# EAGLE design Micromouse Arduino Nano (EAGLE 9.6.2)

## Sheet 1 of 4
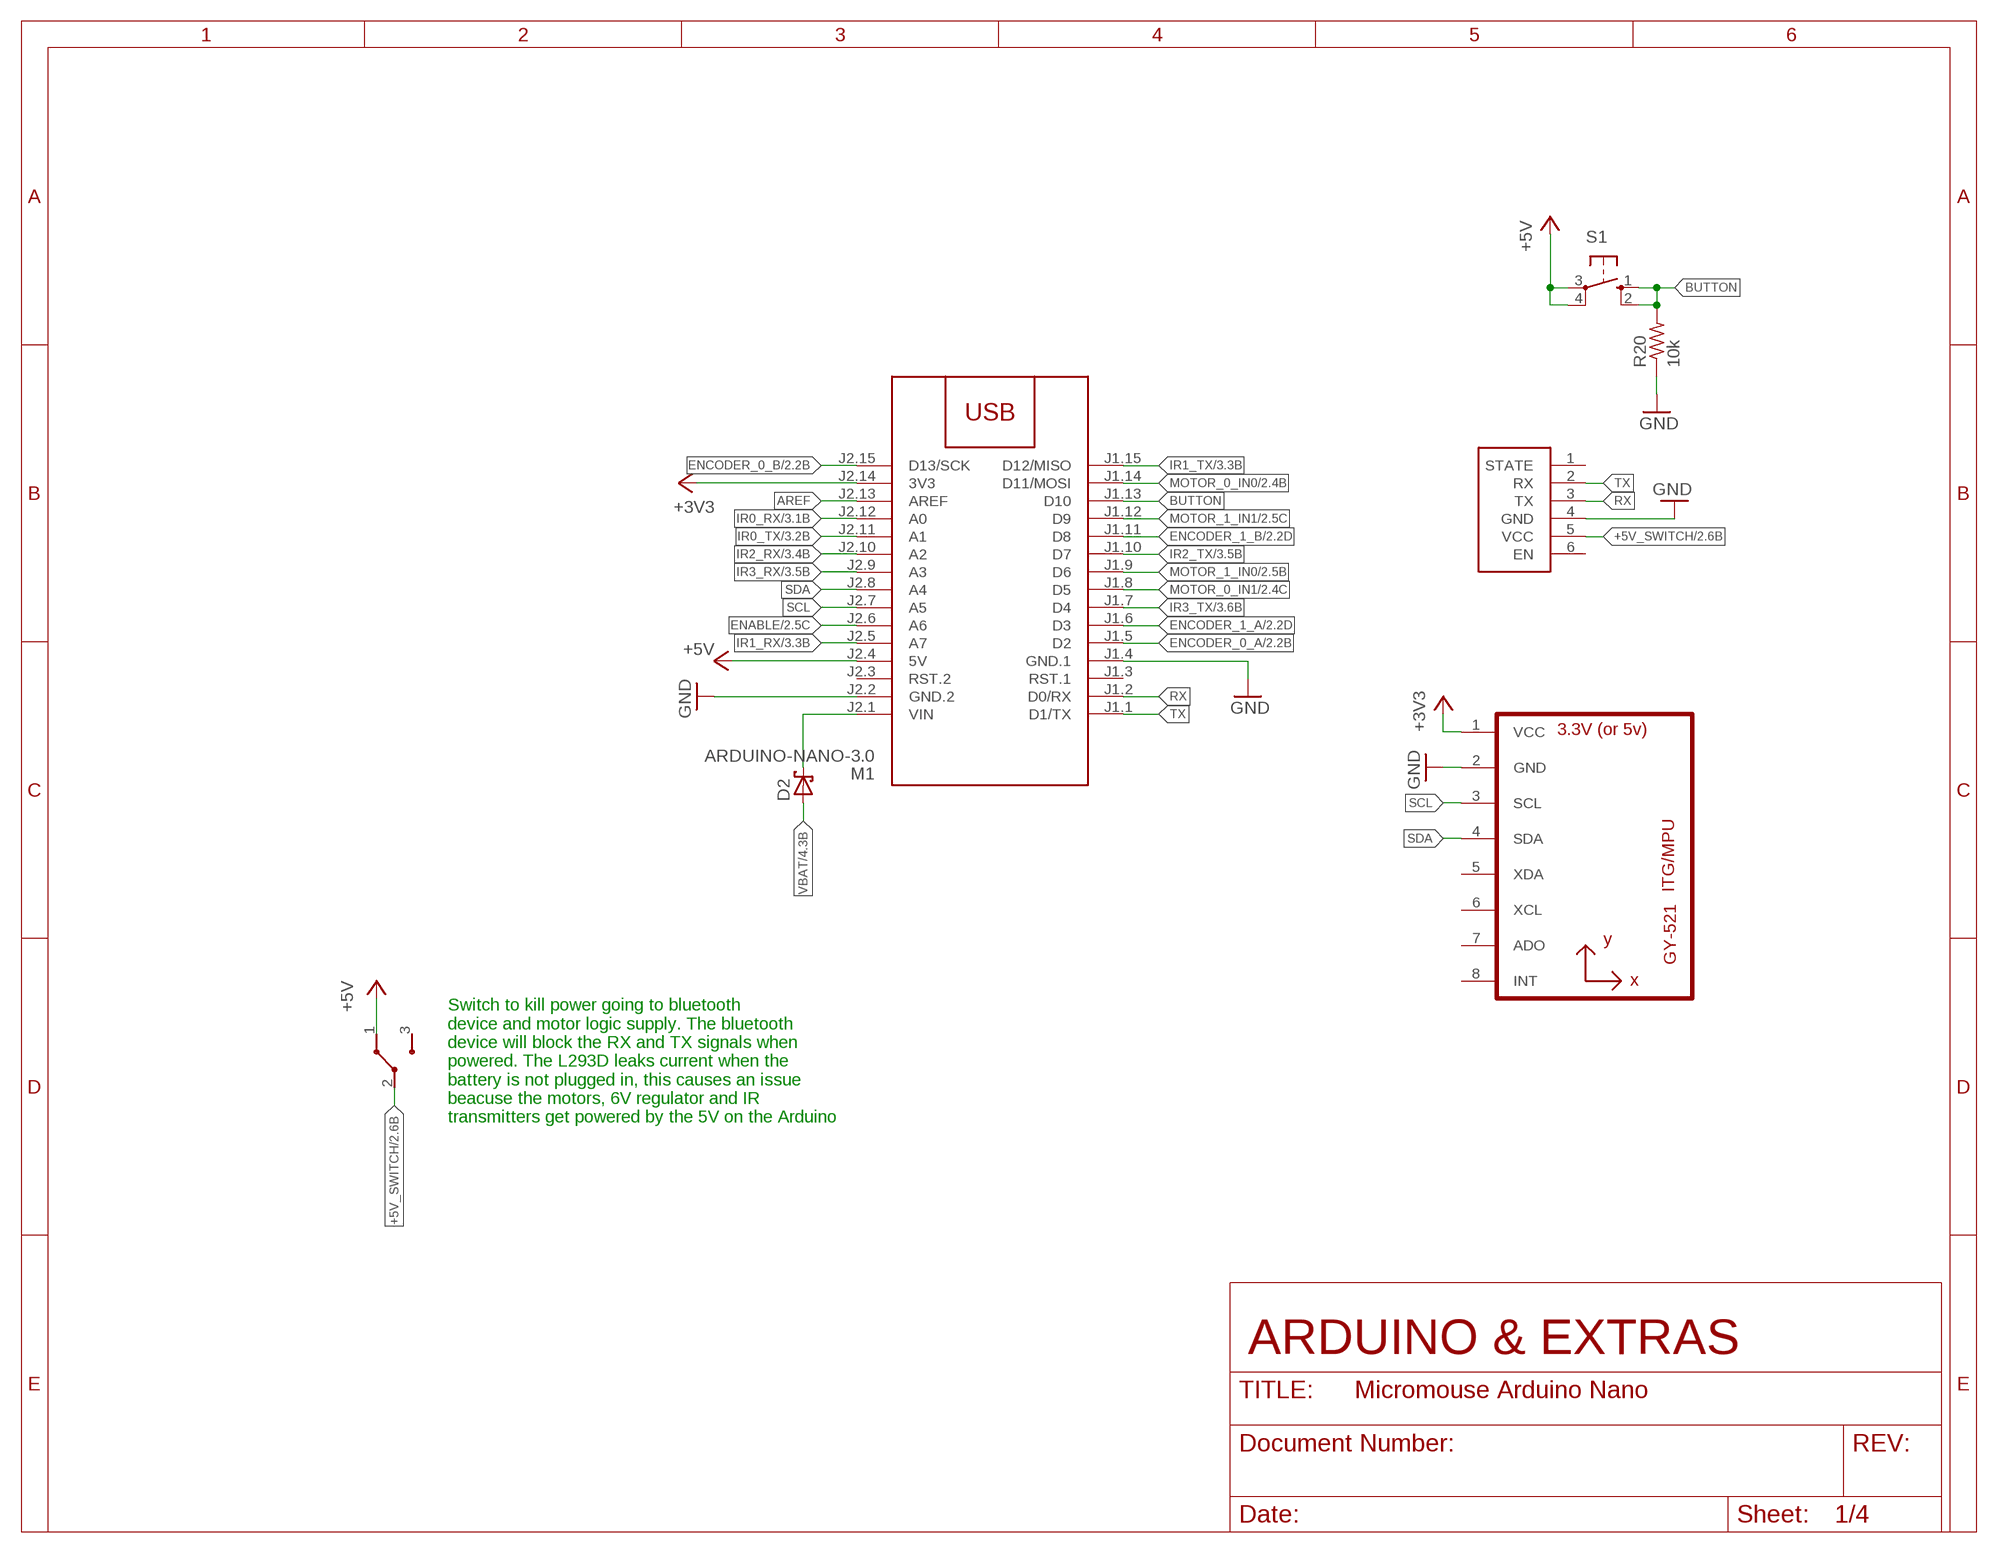
[diagram p0: schematic, sheet 1]

### Parts
D2  SCHOTTKY-DIODEDO41-7  [DO41-7]
M1  ARDUINO-NANO-3.0  [ARDUINO-NANO-3.0]
R20  10k  R-US_0207/2V  [0207/2V]
S1  10-XX  [B3F-10XX]
U1  GY-521MPU6050  [GY-521]
U$9  HC-05  [HC-05]
U$10  K3-1260D  [K3-1260D]

### Nets
+3V3: M1.J2.14(3V3) U1.1(VCC)
+5V: M1.J2.4(5V) S1.3(P) S1.4(P1) U$10.1 ; also sheet 2,3
+5V_SWITCH: U$9.5(VCC) U$10.2 ; also sheet 2
AREF: M1.J2.13(AREF)
BUTTON: M1.J1.13(D10) R20.2 S1.1(S) S1.2(S1)
ENABLE: M1.J2.6(A6) ; also sheet 2
ENCODER_0_A: M1.J1.5(D2) ; also sheet 2
ENCODER_0_B: M1.J2.15(D13/SCK) ; also sheet 2
ENCODER_1_A: M1.J1.6(D3) ; also sheet 2
ENCODER_1_B: M1.J1.11(D8) ; also sheet 2
GND: M1.J1.4(GND.1) M1.J2.2(GND.2) R20.1 U1.2(GND) U$9.4(GND) ; also sheet 2,3,4
IR0_RX: M1.J2.12(A0) ; also sheet 3
IR0_TX: M1.J2.11(A1) ; also sheet 3
IR1_RX: M1.J2.5(A7) ; also sheet 3
IR1_TX: M1.J1.15(D12/MISO) ; also sheet 3
IR2_RX: M1.J2.10(A2) ; also sheet 3
IR2_TX: M1.J1.10(D7) ; also sheet 3
IR3_RX: M1.J2.9(A3) ; also sheet 3
IR3_TX: M1.J1.7(D4) ; also sheet 3
MOTOR_0_IN0: M1.J1.14(D11/MOSI) ; also sheet 2
MOTOR_0_IN1: M1.J1.8(D5) ; also sheet 2
MOTOR_1_IN0: M1.J1.9(D6) ; also sheet 2
MOTOR_1_IN1: M1.J1.12(D9) ; also sheet 2
N$7: D2.C M1.J2.1(VIN)
RX: M1.J1.2(D0/RX) U$9.3(TX)
SCL: M1.J2.7(A5) U1.3(SCL)
SDA: M1.J2.8(A4) U1.4(SDA)
TX: M1.J1.1(D1/TX) U$9.2(RX)
VBAT: D2.A ; also sheet 4
Unconnected: M1.J1.3(RST.1) M1.J2.3(RST.2) U1.5(XDA) U1.6(XCL) U1.7(ADO) U1.8(INT) U$9.1(STATE) U$9.6(EN) U$10.3

### Notes on the sheet
- Switch to kill power going to bluetooth 
  device and motor logic supply. The bluetooth 
  device will block the RX and TX signals when 
  powered. The L293D leaks current when the 
  battery is not plugged in, this causes an issue 
  beacuse the motors, 6V regulator and IR 
  transmitters get powered by the 5V on the Arduino
- ARDUINO & EXTRAS

## Sheet 2 of 4
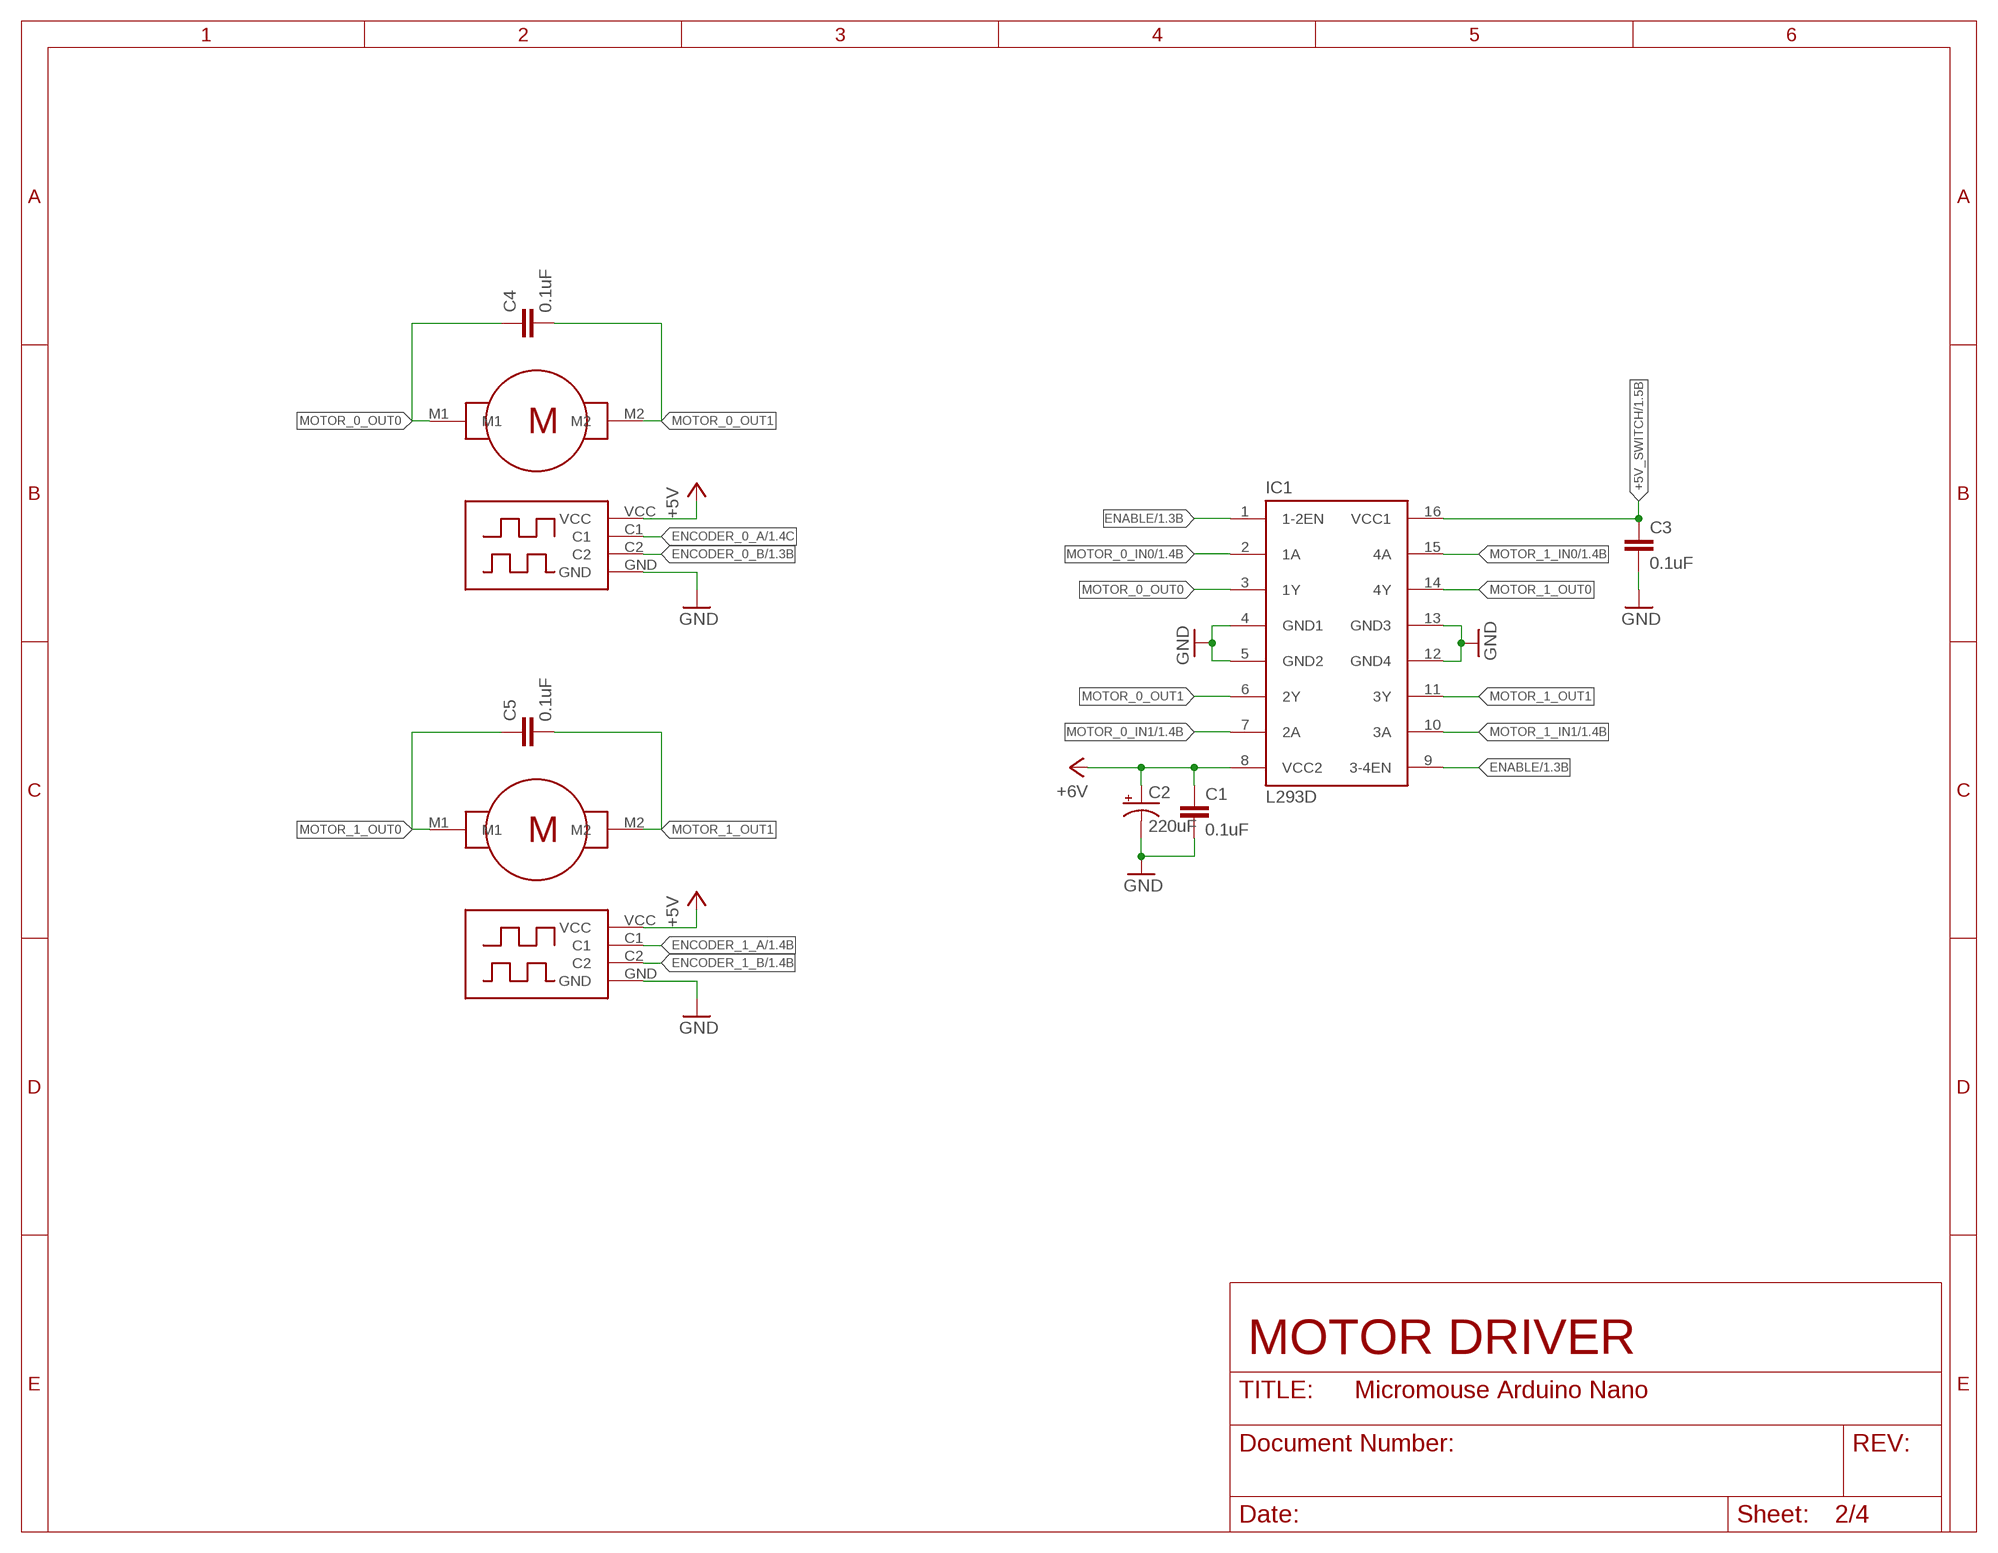
[diagram p1: schematic, sheet 2]

### Parts
C1  0.1uF  C-EU050-025X075  [C050-025X075]
C2  220uF  CPOL-USE2.5-6  [E2,5-6]
C3  0.1uF  C-EU050-025X075  [C050-025X075]
C4  0.1uF  C-EU050-025X075  [C050-025X075]
C5  0.1uF  C-EU050-025X075  [C050-025X075]
IC1  L293D  [DIL16]
U$1  DC_MOTOR  [DC_MOTOR]
U$2  DC_MOTOR  [DC_MOTOR]

### Nets
+5V: U$1.VCC U$2.VCC ; also sheet 1,3
+5V_SWITCH: C3.1 IC1.16(VCC1) ; also sheet 1
ENABLE: IC1.1(1-2EN) IC1.9(3-4EN) ; also sheet 1
ENCODER_0_A: U$1.C1 ; also sheet 1
ENCODER_0_B: U$1.C2 ; also sheet 1
ENCODER_1_A: U$2.C1 ; also sheet 1
ENCODER_1_B: U$2.C2 ; also sheet 1
GND: C1.2 C2.- C3.2 IC1.4(GND1) IC1.5(GND2) IC1.12(GND4) IC1.13(GND3) U$1.GND U$2.GND ; also sheet 1,3,4
MOTOR_0_IN0: IC1.2(1A) ; also sheet 1
MOTOR_0_IN1: IC1.7(2A) ; also sheet 1
MOTOR_0_OUT0: C4.1 IC1.3(1Y) U$1.M1
MOTOR_0_OUT1: C4.2 IC1.6(2Y) U$1.M2
MOTOR_1_IN0: IC1.15(4A) ; also sheet 1
MOTOR_1_IN1: IC1.10(3A) ; also sheet 1
MOTOR_1_OUT0: C5.1 IC1.14(4Y) U$2.M1
MOTOR_1_OUT1: C5.2 IC1.11(3Y) U$2.M2
VCC: C1.1 C2.+ IC1.8(VCC2) ; supply symbol labelled +6V ; also sheet 3,4

### Notes on the sheet
- MOTOR DRIVER

## Sheet 3 of 4
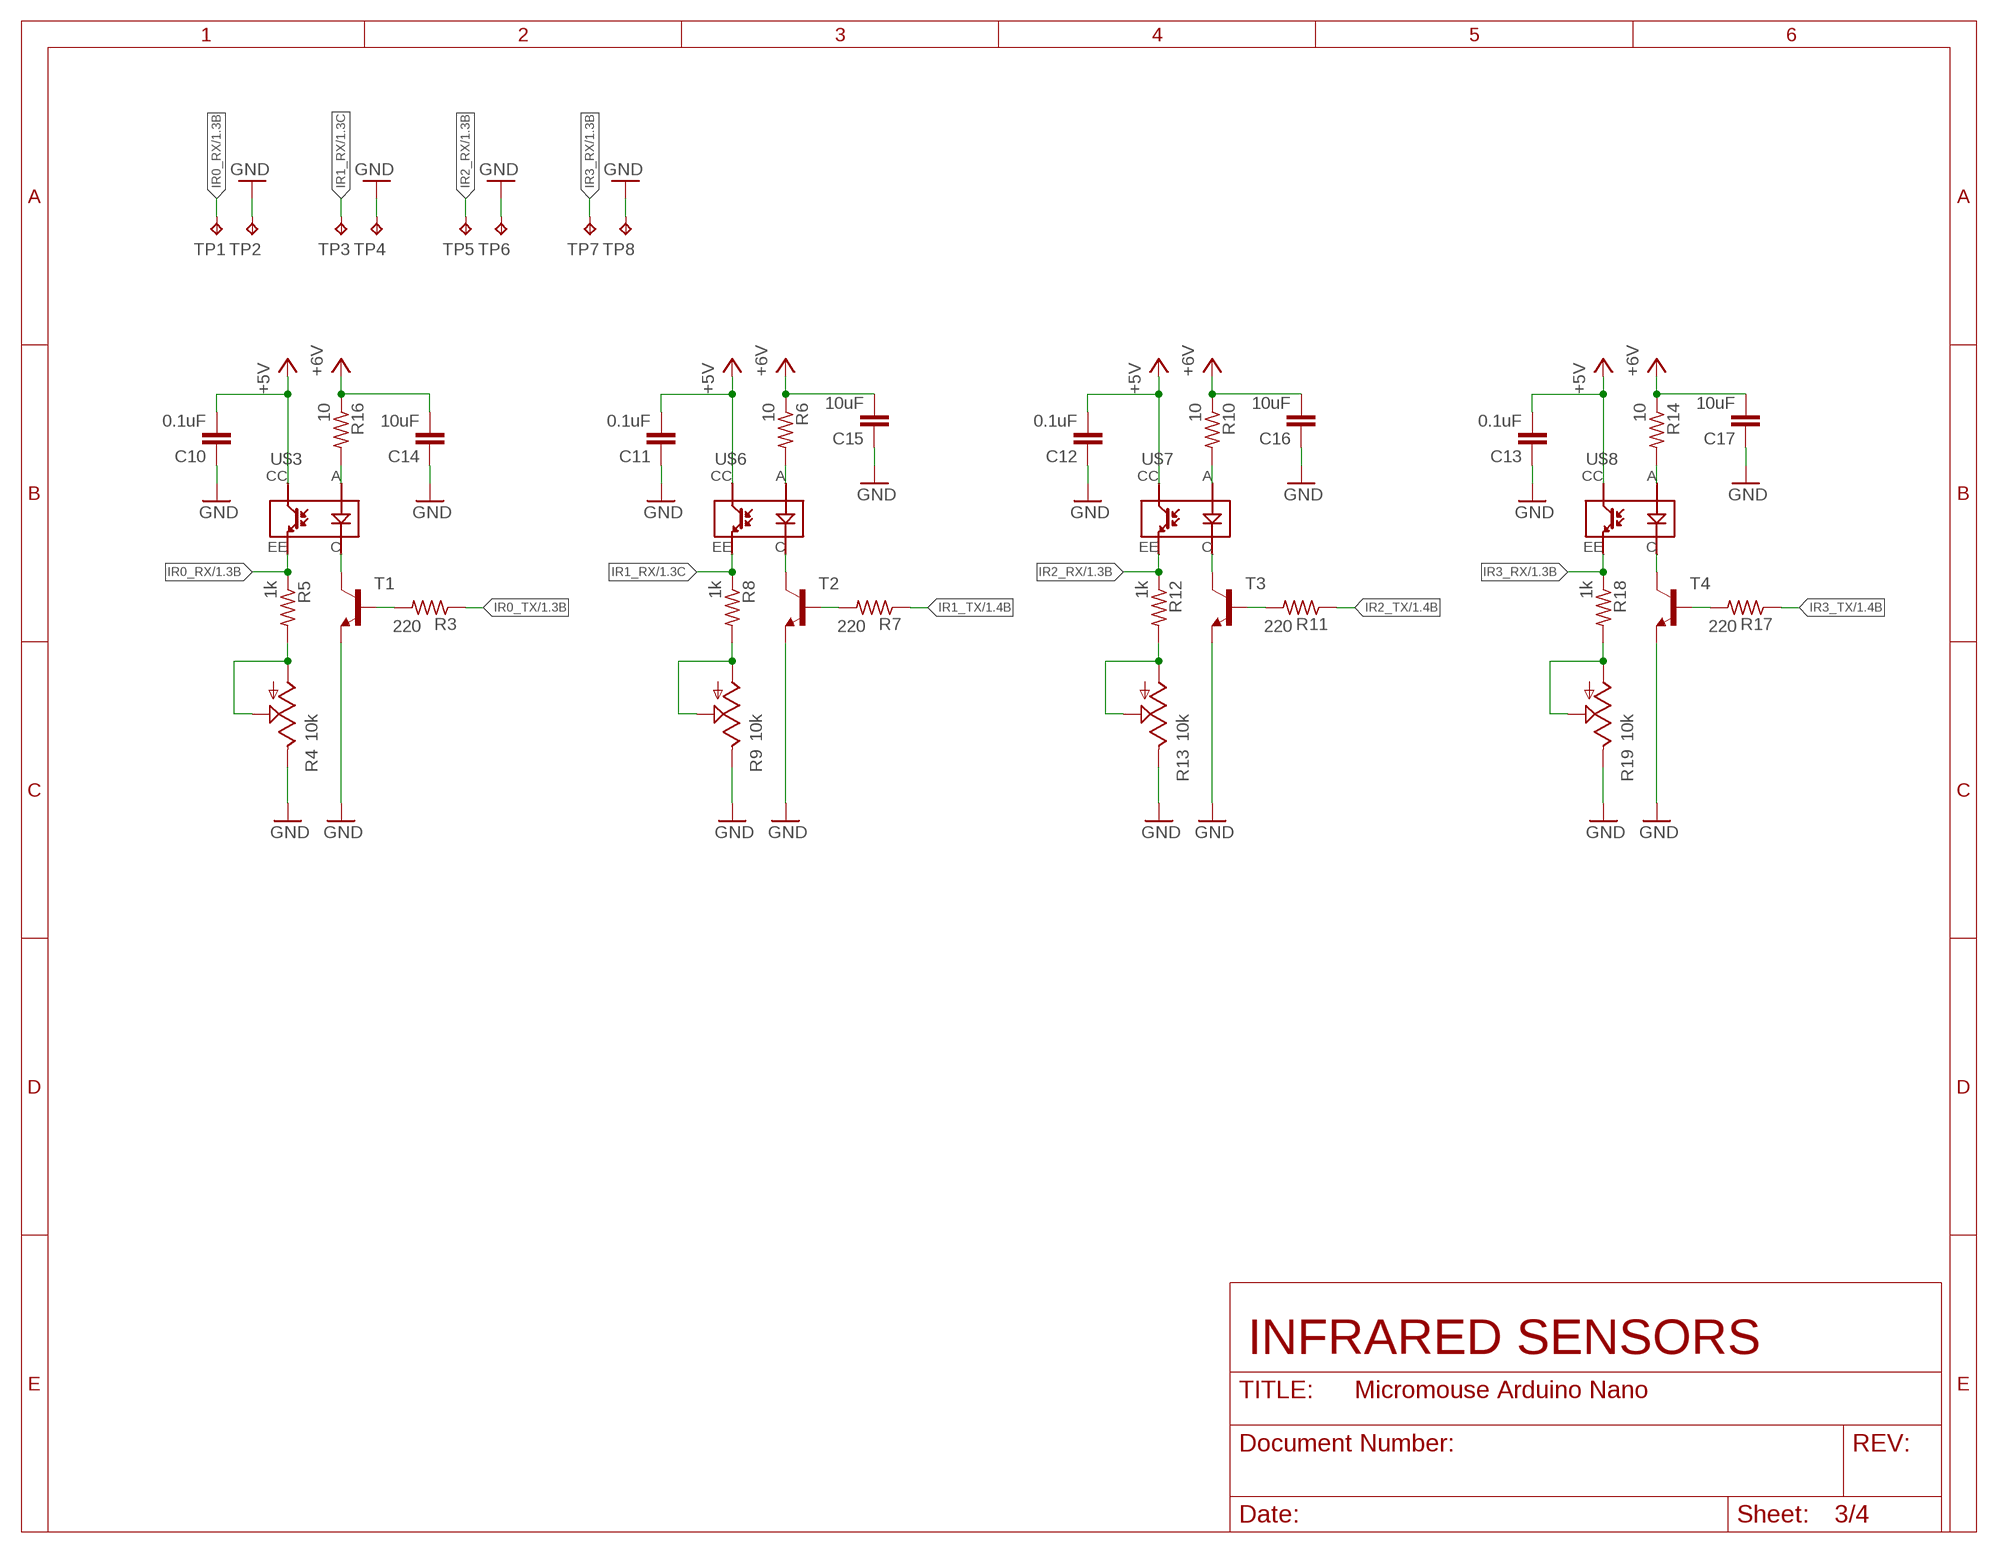
[diagram p2: schematic, sheet 3]

### Parts
C10  0.1uF  C-EU050-025X075  [C050-025X075]
C11  0.1uF  C-EU050-025X075  [C050-025X075]
C12  0.1uF  C-EU050-025X075  [C050-025X075]
C13  0.1uF  C-EU050-025X075  [C050-025X075]
C14  10uF  C-EU050-025X075  [C050-025X075]
C15  10uF  C-EU050-025X075  [C050-025X075]
C16  10uF  C-EU050-025X075  [C050-025X075]
C17  10uF  C-EU050-025X075  [C050-025X075]
R3  220  R-US_0207/2V  [0207/2V]
R4  10k  TRIM_US-CT6  [CT6]
R5  1k  R-US_0207/2V  [0207/2V]
R6  10  R-US_0207/2V  [0207/2V]
R7  220  R-US_0207/2V  [0207/2V]
R8  1k  R-US_0207/2V  [0207/2V]
R9  10k  TRIM_US-CT6  [CT6]
R10  10  R-US_0207/2V  [0207/2V]
R11  220  R-US_0207/2V  [0207/2V]
R12  1k  R-US_0207/2V  [0207/2V]
R13  10k  TRIM_US-CT6  [CT6]
R14  10  R-US_0207/2V  [0207/2V]
R16  10  R-US_0207/2V  [0207/2V]
R17  220  R-US_0207/2V  [0207/2V]
R18  1k  R-US_0207/2V  [0207/2V]
R19  10k  TRIM_US-CT6  [CT6]
T1  2N4124-NPN-TO92-CBE  [TO92-CBE]
T2  2N4124-NPN-TO92-CBE  [TO92-CBE]
T3  2N4124-NPN-TO92-CBE  [TO92-CBE]
T4  2N4124-NPN-TO92-CBE  [TO92-CBE]
TP1  TPPAD1-13  [P1-13]
TP2  TPPAD1-13  [P1-13]
TP3  TPPAD1-13  [P1-13]
TP4  TPPAD1-13  [P1-13]
TP5  TPPAD1-13  [P1-13]
TP6  TPPAD1-13  [P1-13]
TP7  TPPAD1-13  [P1-13]
TP8  TPPAD1-13  [P1-13]
U$3  IR_DISTANCE_1X2  [IR_DISTANCE_1X2]
U$6  IR_DISTANCE_1X2  [IR_DISTANCE_1X2]
U$7  IR_DISTANCE_1X2  [IR_DISTANCE_1X2]
U$8  IR_DISTANCE_1X2  [IR_DISTANCE_1X2]

### Nets
+5V: C10.2 C11.2 C12.2 C13.2 U$3.CC U$6.CC U$7.CC U$8.CC ; also sheet 1,2
GND: C10.1 C11.1 C12.1 C13.1 C14.1 C15.1 C16.1 C17.1 R4.E R9.E R13.E R19.E T1.E T2.E T3.E T4.E TP2.TP TP4.TP TP6.TP TP8.TP ; also sheet 1,2,4
IR0_RX: R5.1 TP1.TP U$3.EE ; also sheet 1
IR0_TX: R3.1 ; also sheet 1
IR1_RX: R8.1 TP3.TP U$6.EE ; also sheet 1
IR1_TX: R7.1 ; also sheet 1
IR2_RX: R12.1 TP5.TP U$7.EE ; also sheet 1
IR2_TX: R11.1 ; also sheet 1
IR3_RX: R18.1 TP7.TP U$8.EE ; also sheet 1
IR3_TX: R17.1 ; also sheet 1
N$1: T1.C U$3.C
N$2: R3.2 T1.B
N$3: R16.2 U$3.A
N$4: R6.2 U$6.A
N$5: R4.A R4.S R5.2
N$8: T2.C U$6.C
N$9: R7.2 T2.B
N$10: R8.2 R9.A R9.S
N$11: R10.2 U$7.A
N$12: T3.C U$7.C
N$13: R11.2 T3.B
N$17: R12.2 R13.A R13.S
N$18: R14.2 U$8.A
N$19: T4.C U$8.C
N$20: R17.2 T4.B
N$21: R18.2 R19.A R19.S
VCC: C14.2 C15.2 C16.2 C17.2 R6.1 R10.1 R14.1 R16.1 ; supply symbol labelled +6V ; also sheet 2,4

### Notes on the sheet
- INFRARED SENSORS

## Sheet 4 of 4
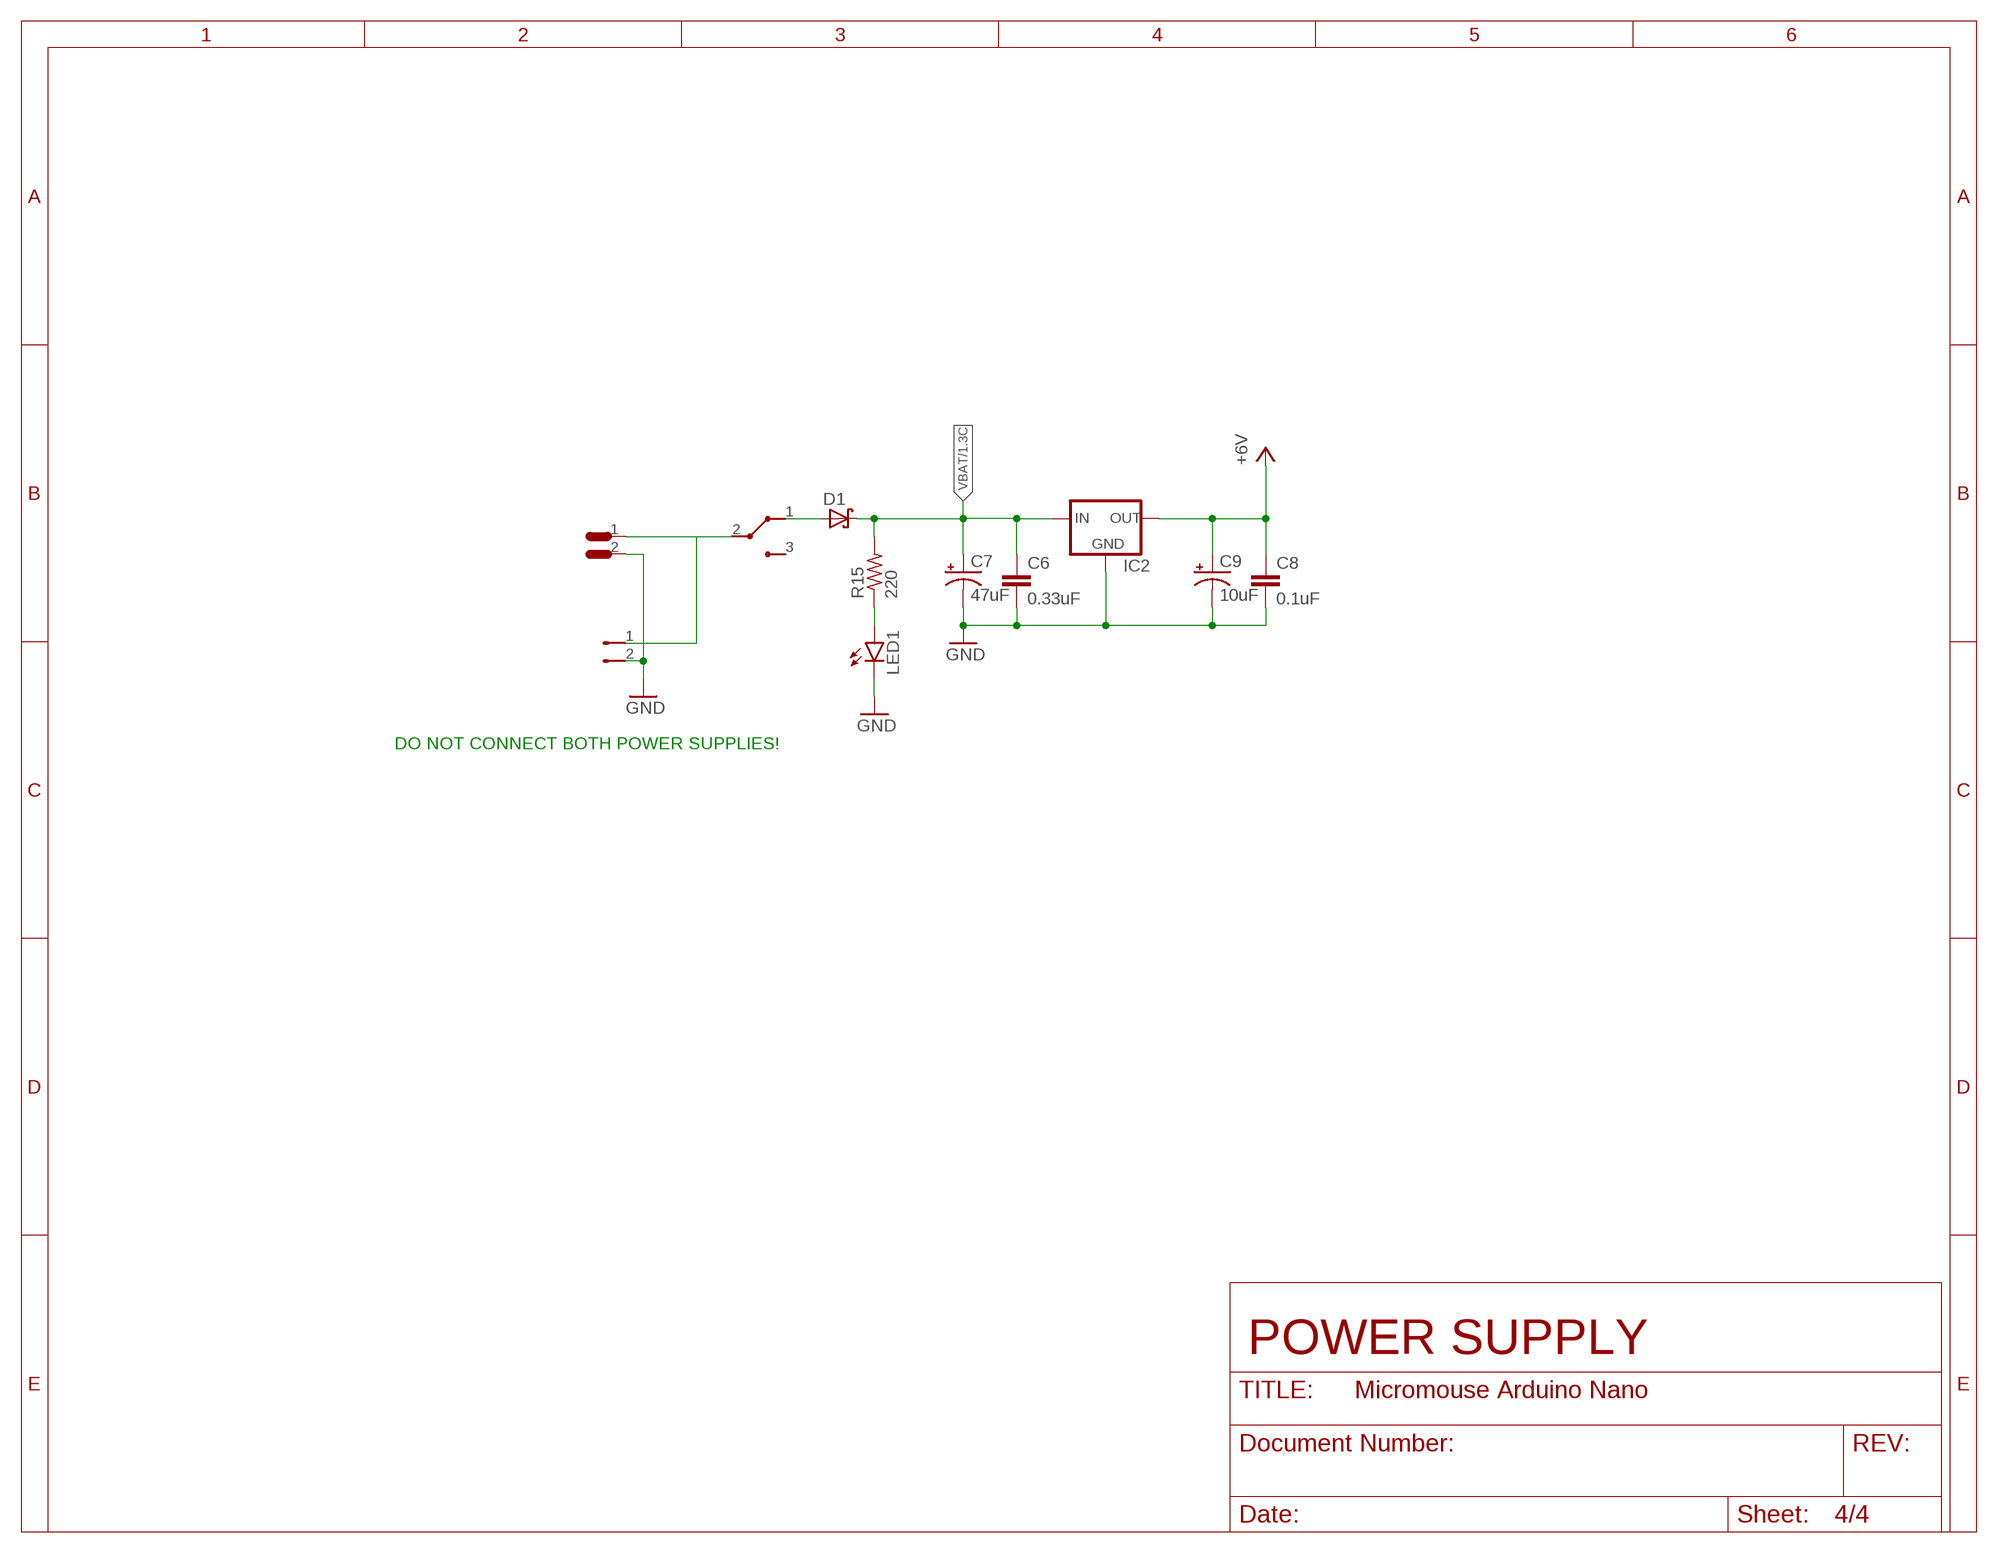
[diagram p3: schematic, sheet 4]

### Parts
C6  0.33uF  C-EU050-025X075  [C050-025X075]
C7  47uF  CPOL-USE2-4  [E2-4]
C8  0.1uF  C-EU050-025X075  [C050-025X075]
C9  10uF  CPOL-USE2.5-5  [E2,5-5]
D1  SCHOTTKY-DIODEDO41-7  [DO41-7]
IC2  78XXS  [78XXS]
LED1  LED5MM  [LED5MM]
R15  220  R-US_0207/2V  [0207/2V]
U$4  K3-1260D  [K3-1260D]
U$5  XT30-M  [XT30-M]
U$12  JST_POWER  [JST_POWER]

### Nets
GND: C6.2 C7.- C8.2 C9.- IC2.GND LED1.K(C) U$5.2 U$12.2 ; also sheet 1,2,3
N$14: D1.A U$4.1
N$15: U$4.2 U$5.1 U$12.1
N$16: LED1.A R15.1
VBAT: C6.1 C7.+ D1.C IC2.IN R15.2 ; also sheet 1
VCC: C8.1 C9.+ IC2.OUT ; supply symbol labelled +6V ; also sheet 2,3
Unconnected: U$4.3

### Notes on the sheet
- DO NOT CONNECT BOTH POWER SUPPLIES!
- POWER SUPPLY

## Library data of the parts
C1 C3-C6 C8 C10-C17 = rcl:C-EU: CAPACITOR, European symbol; SPICEPREFIX: C
C2 C7 C9 = rcl:CPOL-US: POLARIZED CAPACITOR, American symbol; SPICEPREFIX: C
D1 D2 = adafruit:SCHOTTKY-DIODE: Schottky Diode
IC1 = st-microelectronics:L293D: PUSH-PULL 4 CHANNEL DRIVER; MPN: L293D; OC_FARNELL: 9589619; OC_NEWARK: 56P8249
IC2 = v-reg:78XXS: VOLTAGE REGULATOR
LED1 = led:LED: LED OSRAM: - CHIPLED LG R971, LG N971, LY N971, LG Q971, LY Q971, LO R971, LY R971 LH N974, LH R974 LS Q976, LO Q976, LY Q976 LO Q996 - Hyper CHIPLED LW Q18S LB Q993, LB Q99A, LB R99A - SideLED LS A670, LO A670, LY A670, LG A670, LP A670 LB A673, LV A673, LT A673, LW A673 LH A674 LY A675 LS A676, LA A676, LO A676, LY A676, LW A676 LS A679, LY A679, LG A679 - Hyper Micro SIDELED® LS Y876, LA Y876, LO Y876, LY Y876 LT Y87S - SmartLED LW L88C, LW L88S LB L89C, LB L89S, LG L890 LS L89K, LO L89K, LY L89K LS L896, LA L896, LO L896, LY L896 - TOPLED LS T670, LO T670, LY T670, LG T670, LP T670 LSG T670, LSP T670, LSY T670, LOP T670, LYG T670 LG T671, LOG T671, LSG T671 LB T673, LV T673, LT T673, LW T673 LH T674 LS T676, LA T676, LO T676, LY T676, LB T676, LH T676, LSB T676, LW T676 LB T67C, LV T67C, LT T67C, LS T67K, LO T67K, LY T67K, LW E67C LS E67B, LA E67B, LO E67B, LY E67B, LB E67C, LV E67C, LT E67C LW T67C LS T679, LY T679, LG T679 LS T770, LO T770, LY T770, LG T770, LP T770 LB T773, LV T773, LT T773, LW T773 LH T774 LS E675, LA E675, LY E675, LS T675 LS T776, LA T776, LO T776, LY T776, LB T776 LHGB T686 LT T68C, LB T68C - Hyper Mini TOPLED® LB M676 - Mini TOPLED Santana® LG M470 LS M47K, LO M47K, LY M47K Source: http://www.osram.convergy.de LUXEON: - LUMILED® LXK2-PW12-R00, LXK2-PW12-S00, LXK2-PW14-U00, LXK2-PW14-V00 LXK2-PM12-R00, LXK2-PM12-S00, LXK2-PM14-U00 LXK2-PE12-Q00, LXK2-PE12-R00, LXK2-PE12-S00, LXK2-PE14-T00, LXK2-PE14-U00 LXK2-PB12-K00, LXK2-PB12-L00, LXK2-PB12-M00, LXK2-PB14-N00, LXK2-PB14-P00, LXK2-PB14-Q00 LXK2-PR12-L00, LXK2-PR12-M00, LXK2-PR14-Q00, LXK2-PR14-R00 LXK2-PD12-Q00, LXK2-PD12-R00, LXK2-PD12-S00 LXK2-PH12-R00, LXK2-PH12-S00 LXK2-PL12-P00, LXK2-PL12-Q00, LXK2-PL12-R00 Source: www.luxeon.com KINGBRIGHT: KA-3528ASYC Source: www.kingbright.com
M1 = diy-modules:ARDUINO-NANO-3.0: Arduino Nano 3.0 and compatible devices More details available here: https://www.arduino.cc/en/Main/ArduinoBoardNano Click here to find device on ebay.com <http://www.ebay.com/sch/arduino+nano>
R3 R5-R8 R10-R12 R14-R18 R20 = rcl:R-US_: RESISTOR, American symbol; SPICEPREFIX: R
R4 R9 R13 R19 = pot:TRIM_US-: POTENTIOMETER
S1 = switch-omron:10-XX: OMRON SWITCH; MPN: B3F-1000; OC_FARNELL: 176432; OC_NEWARK: 36M3542
T1-T4 = transistor:*-NPN-: NPN Transistror BF959 corrected 2008.03.06
TP1-TP8 = testpad:TP: Test pad
U1 = gy-521:GY-521
U$1 U$2 = DC_MOTOR:DC_MOTOR
U$3 U$6-U$8 = ir_distance:IR_DISTANCE_1X2
U$4 U$10 = K3-1260D:K3-1260D
U$5 = XT30:XT30-M
U$9 = HC-05:HC-05
U$12 = JST_power:JST_POWER

## Board
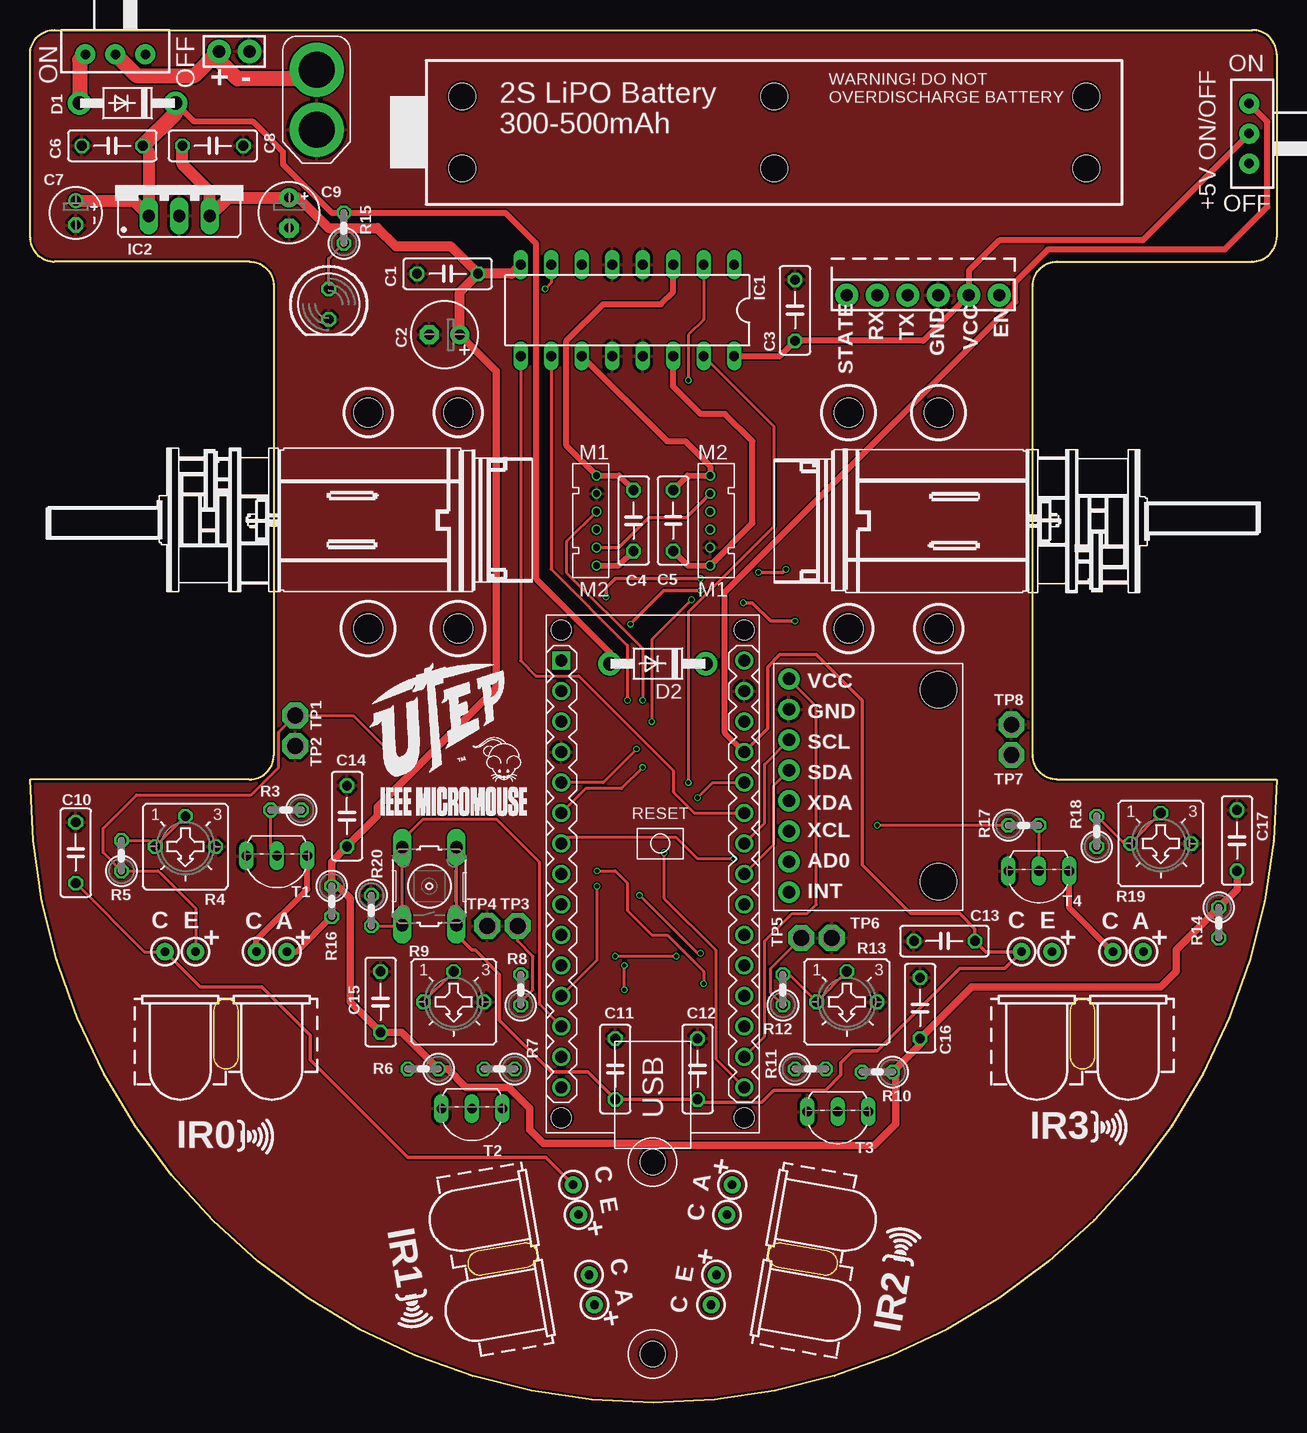
[diagram p4: board, top side]
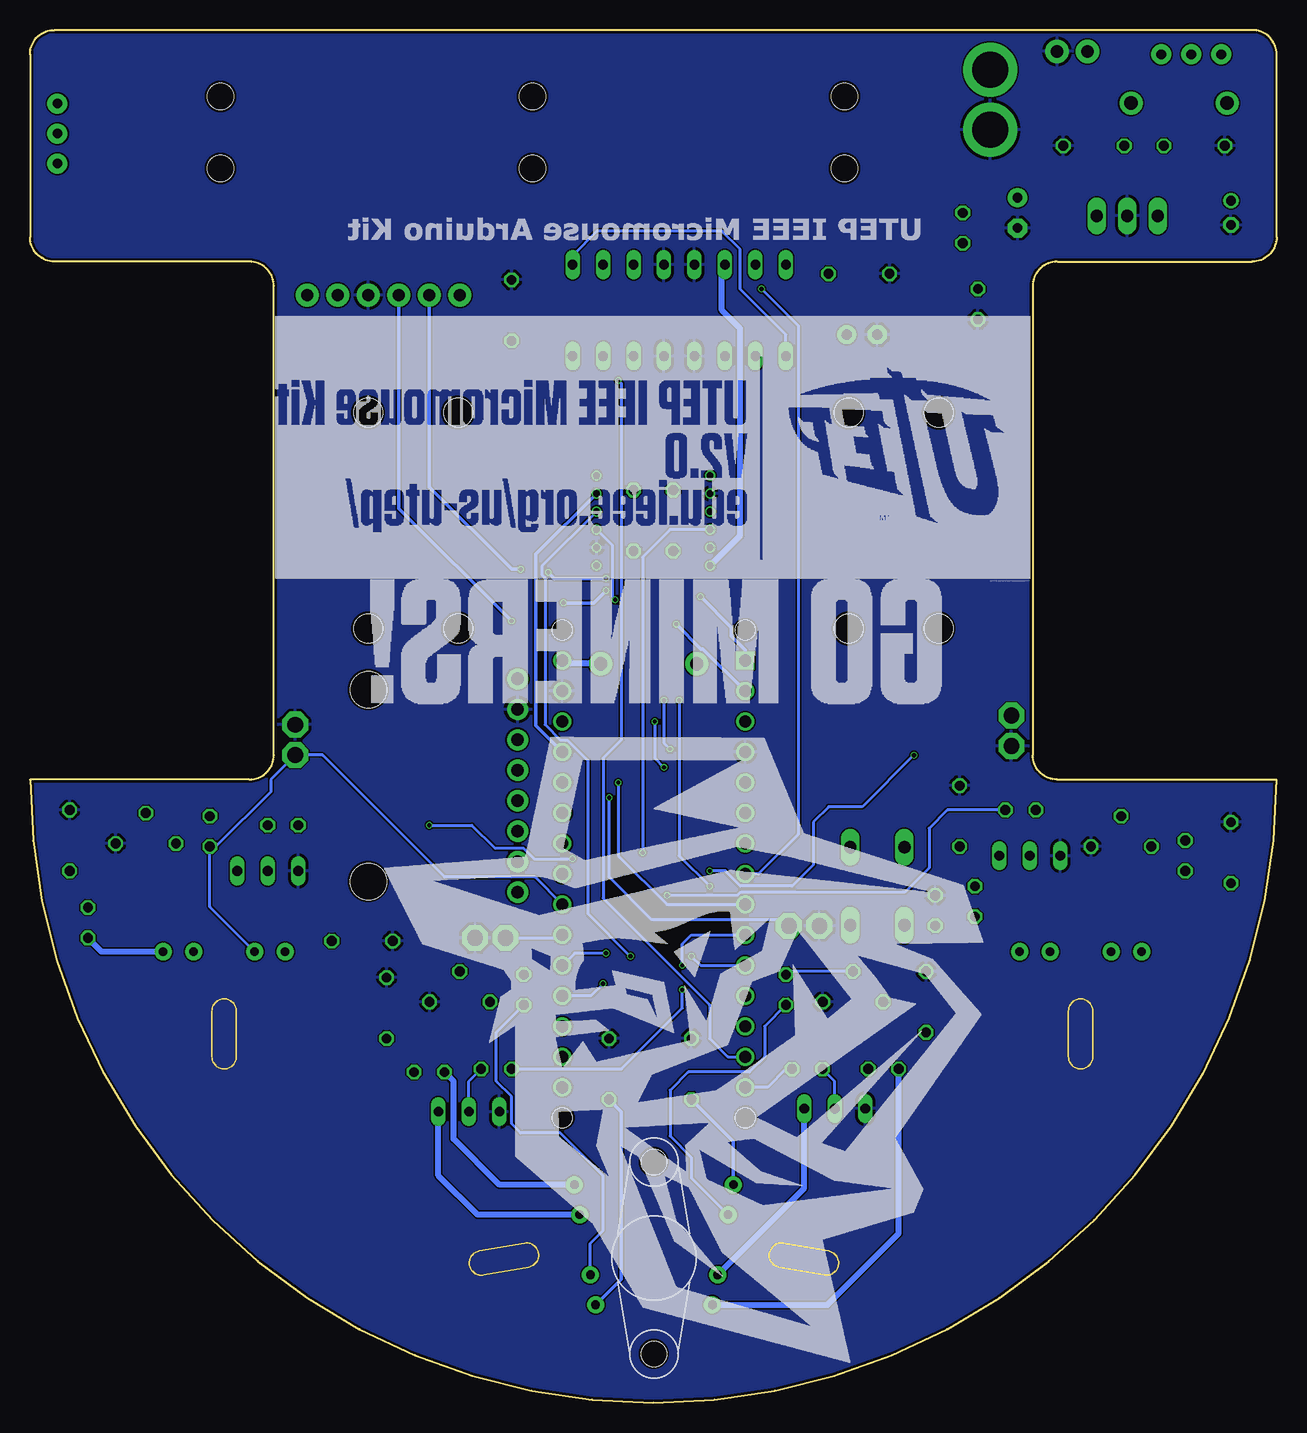
[diagram p5: board, bottom side, seen from below]

Size 103.89 x 114.43 mm. Coordinates in mm from the lower left corner, seen from the top.
Outline: 20.32,93.09 20.32,53.97 arc-90 18.29,51.94 0,51.94 arc180 103.89,51.94 85.6,51.94 arc-90 83.57,53.97 83.57,93.09 arc-90 85.6,95.12 101.85,95.12 arc90 103.89,97.16 103.89,112.39 arc90 101.85,114.43 2.03,114.43 arc90 0,112.39 0,97.16 arc90 2.03,95.12 18.29,95.12 arc-90 20.32,93.09
Copper layers (1*16): Top 0.035559375mm / dielectric 1.6mm / Bottom 0.035559375mm
Design rules "jlcpcb2layer": minimum track width 5mil, minimum drill 12mil, track to track 5mil, track to pad 5mil, pad to pad 5mil, via to via 5mil, smd to smd 5mil, copper to edge 8mil, drill to drill 6mil, minimum pad ring 5mil, minimum via ring 3mil, stop-mask expansion 2.5mil, vias tented up to drill 0mil, thermal gap 10mil

### Footprints (pad centres in the part's own frame; a part is rotated, then mirrored left to right if it is on the bottom)
C050-025X075 = drill 0.813 octagon: 1 -2.54,0; 2 2.54,0
E2,5-6 = drill 0.813 pad 1.6: + -1.27,0 | drill 0.813 pad 1.6 octagon: - 1.27,0
E2-4 = drill 0.813 pad 1.27: + -1.016,0 | drill 0.813 pad 1.27 octagon: - 1.016,0
E2,5-5 = drill 0.813 pad 1.6: + -1.27,0 | drill 0.813 pad 1.6 octagon: - 1.27,0
DO41-7 = drill 1.118 pad 1.93: A 4,0; C -4,0
DIL16 = drill 0.813 long: 1 -8.89,-3.81; 2 -6.35,-3.81; 3 -3.81,-3.81; 4 -1.27,-3.81; 5 1.27,-3.81; 6 3.81,-3.81; 7 6.35,-3.81; 8 8.89,-3.81; 9 8.89,3.81; 10 6.35,3.81; 11 3.81,3.81; 12 1.27,3.81; 13 -1.27,3.81; 14 -3.81,3.81; 15 -6.35,3.81; 16 -8.89,3.81
78XXS = drill 1.016 long: GND 0,-2.54; IN -2.54,-2.54; OUT 2.54,-2.54
LED5MM = drill 0.813 octagon: A -1.27,0; K 1.27,0
ARDUINO-NANO-3.0 = drill 1 square: J1.1 17.78,7.62 | drill 1: J1.2 15.24,7.62; J1.3 12.7,7.62; J1.4 10.16,7.62; J1.5 7.62,7.62; J1.6 5.08,7.62; J1.7 2.54,7.62; J1.8 0,7.62; J1.9 -2.54,7.62; J1.10 -5.08,7.62; J1.11 -7.62,7.62; J1.12 -10.16,7.62; J1.13 -12.7,7.62; J1.14 -15.24,7.62; J1.15 -17.78,7.62; J2.1 17.78,-7.62; J2.2 15.24,-7.62; J2.3 12.7,-7.62; J2.4 10.16,-7.62; J2.5 7.62,-7.62; J2.6 5.08,-7.62; J2.7 2.54,-7.62; J2.8 0,-7.62; J2.9 -2.54,-7.62; J2.10 -5.08,-7.62; J2.11 -7.62,-7.62; J2.12 -10.16,-7.62; J2.13 -12.7,-7.62; J2.14 -15.24,-7.62; J2.15 -17.78,-7.62 | hole 1.651: -20.32,7.62; -20.32,-7.62; 20.32,-7.62; 20.32,7.62
0207/2V = drill 0.813 octagon: 1 -1.27,0; 2 1.27,0
CT6 = drill 0.813 octagon: A 2.515,0; E -2.515,0; S 0,-2.54
B3F-10XX = drill 1.016 long: 1 -3.251,2.261; 2 3.251,2.261; 3 -3.251,-2.261; 4 3.251,-2.261
TO92-CBE = drill 0.813 long: B 0,0; C -2.54,0; E 2.54,0
P1-13 = drill 1.321 pad 2.159 octagon: TP 0,0
GY-521 = drill 1.041 pad 1.778: 1 1.27,19.304; 2 1.27,16.764; 3 1.27,14.224; 4 1.27,11.684; 5 1.27,9.144; 6 1.27,6.604; 7 1.27,4.064; 8 1.27,1.524 | hole 3.023: 13.716,18.415; 13.716,2.413
DC_MOTOR = drill 0.55: C1 20.54,0.75; C2 20.54,-0.75; GND 20.54,2.25; M1 20.54,3.75; M2 20.54,-3.75; VCC 20.54,-2.25 | hole 2.4: 1.5,9; 1.5,-9; 9,9; 9,-9
IR_DISTANCE_1X2 = drill 0.711 pad 1.422: A -5.08,-1.905; C -2.54,-1.905; CC 5.08,-1.905; EE 2.54,-1.905
K3-1260D = drill 0.8 pad 1.676: 1 -2.5,0; 2 0,0; 3 2.5,0
XT30-M = drill 3 pad 4.5: 1 0,0; 2 0,-5
HC-05 = drill 1.016 pad 1.93: 1 0,0; 2 2.54,0; 3 5.08,0; 4 7.62,0; 5 10.16,0; 6 12.7,0
CASTER_WHEEL = hole 2.1: 0,8; 0,-8
JST_POWER = drill 1.041 pad 1.956: 1 0,0; 2 2.54,0
LIPO = hole 2.2: 3,-3; 3,-9; 55,-3; 55,-9; 29,-3; 29,-9

### Placement (x,y rotation side)
C1  34.8,94.11 180 top
C2  34.54,89.03 180 top
C3  63.75,91.06 90 top
C4  50.29,73.53 270 top
C5  53.59,73.53 90 top
C6  6.86,104.77 180 top
C7  3.81,99.19 270 top
C8  15.24,104.77 0 top
C9  21.59,99.19 270 top
C10  3.81,45.85 270 top
C11  48.77,27.81 270 top
C12  55.63,27.81 270 top
C13  76.2,38.48 0 top
C14  26.42,48.89 270 top
C15  29.21,33.4 270 top
C16  74.17,32.89 270 top
C17  100.58,46.86 270 top
D1  8.13,108.33 180 top
D2  52.32,61.59 180 top
IC1  49.78,91.06 180 top
IC2  12.45,101.47 0 top
LED1  24.89,91.57 270 top
M1  51.89,44.07 90 top
R3  21.34,49.4 180 top
R4  12.95,46.35 180 top
R5  7.62,45.59 90 top
R6  32.77,27.81 180 top
R7  39.12,27.81 180 top
R8  40.89,34.42 90 top
R9  35.31,33.4 180 top
R10  70.61,27.56 180 top
R11  65.02,27.81 0 top
R12  62.74,34.42 90 top
R13  68.07,33.4 180 top
R14  99.06,40 270 top
R15  26.16,97.92 90 top
R16  25.15,41.78 270 top
R17  82.8,48.13 0 top
R18  88.9,47.62 90 top
R19  94.23,46.61 180 top
R20  28.45,41.02 270 top
S1  33.27,43.05 90 top
T1  20.57,45.59 180 top
T2  36.83,24.51 180 top
T3  67.31,24.26 180 top
T4  84.07,44.32 180 top
TP1  22.1,57.28 270 top
TP2  22.1,54.74 270 top
TP3  40.64,39.75 180 top
TP4  38.1,39.75 180 top
TP5  64.26,38.73 0 top
TP6  66.8,38.73 0 top
TP7  81.79,53.97 90 top
TP8  81.79,56.51 90 top
U1  61.98,41.02 0 top
U$1  26.67,73.53 0 top
U$2  77.22,73.53 180 top
U$3  16.33,35.69 180 top
U$4  7.11,112.39 0 top
U$5  23.88,111.12 0 top
U$6  44.27,12.83 100 top
U$7  59.51,12.83 260 top
U$8  87.71,35.69 180 top
U$9  68.07,92.33 0 top
U$10  101.6,105.79 270 top
U$11  [CASTER_WHEEL]  51.89,12.06 0 top
U$12  15.75,112.65 0 top
U$13  [MICROMOUSE]  27.43,48.64 0 top
U$14  [IR_SENSOR]  17.53,22.22 0 top
U$15  [IR_SENSOR]  31.75,9.02 280 top
U$16  [IR_SENSOR]  72.39,11.81 80 top
U$17  [IR_SENSOR]  88.65,22.99 0 top
U$18  [MICROMOUSE_TEXT]  20.57,68.71 0 top
U$19  [MINER_LOGO]  27.94,58.29 0 top
U$20  [MICROMOUSE_TEXT_1]  29.72,96.9 0 top
U$21  [LIPO]  33.02,111.89 0 top

### Tracks (layer width: path | path; a pad name or v marks a point on that pad's centre or on a via)
+3V3
  Top 0.254: M1.J2.14 61.21,30.53 61.21,38.48 63.5,40.77 64.77,40.77 65.53,41.53 65.53,58.04 U1.1
+5V
  Top 0.254: C10.2 9.53,37.59 U$3.CC | S1.4 S1.3
  Top 0.305: U$1.VCC 49.06,71.28 51.56,73.79 54.68,73.79 U$2.VCC | M1.J2.4 61.47,56.18 61.47,61.34 62.48,62.36 65.53,62.36 69.34,58.55 69.34,44.83 73.41,40.77 77.47,40.77 78.74,39.5 C13.2 79.63,37.59 U$8.CC 81.23,36.19 77.47,36.19 70.61,29.34 68.58,29.34 67.56,28.32 67.56,27.3 66.29,26.03 61.98,26.03 60.96,25.02 55.88,25.02 C12.2 C11.2 46.48,27.56 43.43,27.56 39.12,31.88 39.12,35.69 37.08,37.72 36.83,37.72 35.53,39.01 S1.3 | U$6.CC 42.98,20.45 31.5,20.45 23.37,28.57 23.37,30.61 19.3,34.67 14.17,34.67 U$3.CC
  Top 0.508: M1.J2.4 57.91,55.83 57.91,67.56 82.12,91.77 82.12,93.42 84.84,96.14 99.57,96.14 103.12,99.69 103.12,106.77 U$10.1
  Bottom 0.305: M1.J2.4 61.72,56.44 61.72,70.74 U$2.VCC | C11.2 45.27,21.77 U$6.CC | C12.2 54.61,24.26 54.61,10.29 U$7.CC
+5V_SWITCH
  Top 0.508: U$10.2 92.71,96.9 80.77,96.9 78.23,94.36 U$9.5 74.42,88.52 C3.1 62.48,87.25 IC1.16
BUTTON
  Top 0.254: R20.2 30.96,39.75 S1.1 S1.2 31.01,46.89 32.77,48.64 38.86,48.64 42.42,45.08 42.42,33.22 M1.J1.13
ENABLE
  Top 0.254: IC1.9 40.89,61.85 42.16,60.58 45.72,60.58 53.59,52.7 53.59,50.93 55.37,49.15 M1.J2.6
  Bottom 0.254: IC1.9 40.89,89.03 44.7,92.84 44.7,96.14 46.23,97.66 56.64,97.66 58.67,95.63 IC1.1
ENCODER_0_A  (via drill 0.35)
  Top 0.254: U$1.C1 44.7,71.78 44.7,69.21 51.05,62.86 v51.05,58.55 | v50.55,54.48 47.75,51.69 M1.J1.5
  Bottom 0.254: v51.05,58.55 51.05,54.99 v50.55,54.48
ENCODER_0_B  (via drill 0.35)
  Top 0.254: v52.83,45.85 52.83,42.04 57.15,37.72 57.15,28.65 M1.J2.15
  Bottom 0.254: U$1.C2 50.53,72.78 52.83,70.48 v52.83,45.85
ENCODER_1_A  (via drill 0.35)
  Top 0.254: v55.13,66.93 51.82,63.62 v51.82,56.77 | v51.05,52.96 49.28,51.18 46.3,51.18 M1.J1.6
  Bottom 0.254: U$2.C1 55.36,71.47 55.36,67.48 55.36,67.17 55.12,66.93 v55.13,66.93 | v51.82,56.77 51.82,53.72 v51.05,52.96
ENCODER_1_B  (via drill 0.35)
  Top 0.254: v53.85,37.21 v48.77,37.21
  Bottom 0.254: U$2.C2 61.22,69.74 61.22,69 60.96,68.74 60.96,56.51 59.68,55.23 59.1,55.23 57.4,53.54 57.4,40.77 v53.85,37.21 | v48.77,37.21 48.01,36.45 M1.J1.11
GND
  pour Top: 0,114.43 103.89,114.43 103.89,109.6 103.89,-0.13 41.66,-0.13 0,-0.13 0,51.94
  pour Bottom: 0,114.43 103.89,114.43 103.89,110.36 103.89,50.16 103.89,-0.13 51.05,-0.13 0,-0.13 0,51.94
IR0_RX  (via drill 0.35)
  Top 0.254: U$3.EE 13.79,41.2 10.67,44.32 R5.1 6.1,45.85 6.1,47.88 8.89,50.67 18.45,50.67 20.73,52.95 20.73,55.9 TP1.TP 26.92,57.28 v30.23,53.97 | v47.24,44.32 48.77,44.32 49.78,43.31 49.78,41.02 51.82,38.99 53.09,38.99 56.13,35.94 v56.13,34.92
  Bottom 0.254: v30.23,53.97 34.54,49.66 37.34,49.66 38.61,48.39 38.61,44.83 40.37,43.06 44.69,43.06 45.95,44.32 v47.24,44.32 | v56.13,34.92 57.15,33.91 M1.J2.12
IR0_TX  (via drill 0.35)
  Top 0.254: v50.8,42.29 55.63,37.46 v55.88,37.46
  Bottom 0.254: R3.1 27.43,49.4 28.96,47.88 28.96,44.58 31,42.53 44.69,42.53 44.93,42.29 v50.8,42.29 | v55.88,37.46 58.5,37.46 M1.J2.11
IR1_RX  (via drill 0.35)
  Top 0.254: R8.1 40.89,33.4 41.91,34.42 41.91,37.21 40.64,38.48 TP3.TP | v55.62,50.42 56.89,51.69 M1.J2.5
  Bottom 0.254: R8.1 42.67,31.37 42.67,28.83 43.94,27.56 49.02,27.56 50.55,26.03 50.55,22.22 48.77,20.45 48.77,18.72 U$6.EE | TP3.TP 41.15,40.26 52.07,40.26 55.63,43.81 v55.63,50.41 v55.62,50.42
IR1_TX
  Bottom 0.254: R7.1 40.89,27.81 42.42,26.29 M1.J1.15
IR2_RX
  Top 0.254: R12.1 61.72,34.16 61.72,36.19 TP5.TP
  Bottom 0.254: U$7.EE 57.2,13.29 56.13,14.35 56.13,18.92 59.69,22.48 62.99,22.48 63.75,23.24 63.75,25.53 65.02,26.8 65.02,30.86 R12.1 | TP5.TP 59.77,38.73 M1.J2.10
IR2_TX  (via drill 0.35)
  Top 0.254: v49.53,34.42 v49.53,36.45
  Bottom 0.254: R11.1 54.61,27.81 49.53,32.89 v49.53,34.42 | v49.53,36.45 49.53,38.23 48.77,38.99 M1.J1.10
IR3_RX
  Bottom 0.254: M1.J2.9 61.8,43.81 69.34,43.81 79.5,53.97 TP7.TP 83.82,51.94 83.82,50.93 88.39,46.35 R18.1 88.9,41.33 U$8.EE
IR3_TX  (via drill 0.35)
  Top 0.254: R17.1 v70.61,48.13 | v58.67,45.34 55.63,45.34 53.85,47.12 44.78,47.12 M1.J1.7
  Bottom 0.254: v70.61,48.13 67.06,48.13 65.15,46.23 62.77,46.23 61.88,45.34 v58.67,45.34
MOTOR_0_IN0  (via drill 0.35)
  Top 0.254: IC1.2 56.13,90.3 54.86,89.03 v54.86,85.22
  Bottom 0.254: M1.J1.14 45.72,28.83 47.24,30.35 47.24,33.15 56.13,42.04 56.13,53.72 54.61,55.24 54.61,84.96 v54.86,85.22
MOTOR_0_IN1  (via drill 0.35)
  Top 0.254: IC1.7 43.43,93.34 v42.93,92.84
  Bottom 0.254: v42.93,92.84 39.88,89.79 39.88,47.37 43.18,44.07 M1.J1.8
MOTOR_0_OUT0
  Top 0.508: C4.1 49.08,77.28 U$1.M1 44.7,79.79 44.7,88.52 47.75,91.57 52.58,91.57 53.59,92.58 IC1.3
MOTOR_0_OUT1
  Top 0.508: U$1.M2 49.08,69.78 C4.2
  Bottom 0.508: U$1.M2 44.7,72.29 44.7,89.53 46.23,91.06 46.23,94.61 IC1.6
MOTOR_1_IN0  (via drill 0.35)
  Top 0.254: IC1.15 61.98,81.41 61.98,73.02 54.86,65.91 v54.86,51.69
  Bottom 0.254: v54.86,51.69 54.86,45.59 50.8,41.53 M1.J1.9
MOTOR_1_IN1  (via drill 0.35)
  Top 0.254: IC1.10 43.43,69.47 49.78,63.12 v49.78,58.55 | v47.24,43.05 47.24,36.88 M1.J1.12
  Bottom 0.254: v49.78,58.55 49.78,45.59 v47.24,43.05
MOTOR_1_OUT0
  Top 0.508: IC1.14 53.59,84.71 55.88,82.42 57.91,82.42 60.2,80.14 60.2,73.3 U$2.M1 54.8,69.78 C5.1
MOTOR_1_OUT1
  Top 0.508: IC1.11 53.09,80.14 54.61,80.14 56.68,78.07 U$2.M2 54.8,77.28 C5.2
N$1
  Top 0.508: U$3.C 18.87,38.56 23.11,42.8 T1.C
N$2
  Top 0.254: T1.B 20.07,46.1 R3.2
N$3
  Top 0.508: U$3.A 22.23,37.59 R16.2
N$4
  Bottom 0.508: U$6.A 37.44,8.15 31.5,14.1 R6.2
N$5
  Top 0.254: R5.2 9.93,46.86 R4.A 12.95,48.87 R4.S
N$7
  Bottom 0.508: D2.C 59.26,61.59 M1.J2.1
N$8
  Bottom 0.508: U$6.C 39.37,17.88 T2.C
N$9
  Bottom 0.254: T2.B 36.83,26.8 R7.2
N$10
  Top 0.254: R9.A 35.31,35.92 R9.S
  Bottom 0.254: R9.S 40.64,35.94 R8.2
N$11
  Bottom 0.508: U$7.A 64.77,18.16 68.58,21.97 68.58,26.8 R10.2
N$12
  Bottom 0.508: U$7.C 66.59,15.66 69.85,18.92 T3.C
N$13
  Bottom 0.254: T3.B 67.31,26.8 R11.2
N$14
  Top 1.27: U$4.1 4.13,111.91 D1.A
N$15
  Top 1.27: U$5.1 23.11,110.36 17.27,110.36 15.75,111.89 U$12.1 13.72,110.62 8.89,110.62 U$4.2
N$16
  Top 0.254: LED1.A 24.89,95.38 R15.1
N$17
  Top 0.254: R12.2 63.27,35.69 R13.A 65.56,33.43 R13.S
N$18
  Bottom 0.508: U$8.A 97.92,37.59 R14.2
N$19
  Top 0.508: U$8.C 86.61,41.22 T4.C
N$20
  Top 0.254: R17.2 T4.B
N$21
  Top 0.254: R18.2 91.19,46.61 R19.A 91.72,46.63 R19.S
RX  (via drill 0.35)
  Top 0.305: v63.75,65.15 61.72,65.15 60.2,66.67 v59.44,66.67 | v55.88,67.69 52.83,67.69 v50.04,64.9
  Bottom 0.305: U$9.3 73.15,74.55 v63.75,65.15 | v59.44,66.67 56.9,66.67 v55.88,67.69 | v50.04,64.9 47.98,62.84 47.81,62.84 M1.J1.2
SCL
  Top 0.254: M1.J2.7 61.21,48.31 61.21,53.21 U1.3
SDA
  Top 0.254: M1.J2.8 61.98,46.53 61.98,51.43 U1.4
TX  (via drill 0.35)
  Top 0.305: v62.99,69.47 62.74,69.21 v60.71,69.21 | v55.88,68.71 48.77,68.71 48.01,67.94 v48.01,67.18
  Bottom 0.305: U$9.2 70.61,76.33 63.75,69.47 v62.99,69.47 | v60.71,69.21 60.2,68.71 v55.88,68.71 | v48.01,67.18 45.45,64.63 45.45,63.9 44.27,62.72 M1.J1.1
VBAT
  Top 0.508: D1.C 13.65,106.81 18.54,106.81 21.08,104.27 21.08,103.25 25.15,99.19 R15.2 39.62,99.19 42.16,96.65 42.16,68.71 48.32,62.55 D2.A
  Top 1.016: C6.1 9.91,104.27 IC2.IN 8.64,100.2 C7.+
  Top 1.27: D1.C 12.13,107.5 C6.1
VCC
  Top 0.61: C2.+ 38.86,85.98 38.86,59.56 28.96,49.66 28.96,48.89 C14.2 25.15,45.08 R16.1 25.65,43.05 26.67,42.04 26.67,33.4 C15.2 30.99,30.86 R6.1 34.8,27.81 36.32,26.29 39.88,26.29 41.66,24.51 41.66,22.73 42.77,21.62 52.54,21.62 52.7,21.46 70.36,21.46 72.14,23.24 72.14,27.3 R10.1 74.17,29.84 C16.2 78.49,34.67 94.23,34.67 95.5,35.94 95.5,37.72 R14.1 100.58,42.8 C17.2
  Top 0.813: C9.+ 22.35,100.46 24.89,97.92 28.96,97.92 30.48,96.39 35.05,96.39 C1.1 | C2.+ 35.81,92.58 C1.1 | IC1.8 40.13,94.11 C1.1
  Top 1.016: C8.1 12.7,103.25 14.99,100.96 IC2.OUT 16.51,100.46 C9.+

### Text on the board
tPlace: ON | OFF | ON | 2S LiPO Battery | WARNING! DO NOT / OVERDISCHARGE BATTERY | 300-500mAh | OFF | +5V ON/OFF | IR3 | IR0 | IR1 | IR2